# Altium schematic sheet matrix.SchDoc
size C; SheetNumber: 1; SheetTotal: 1
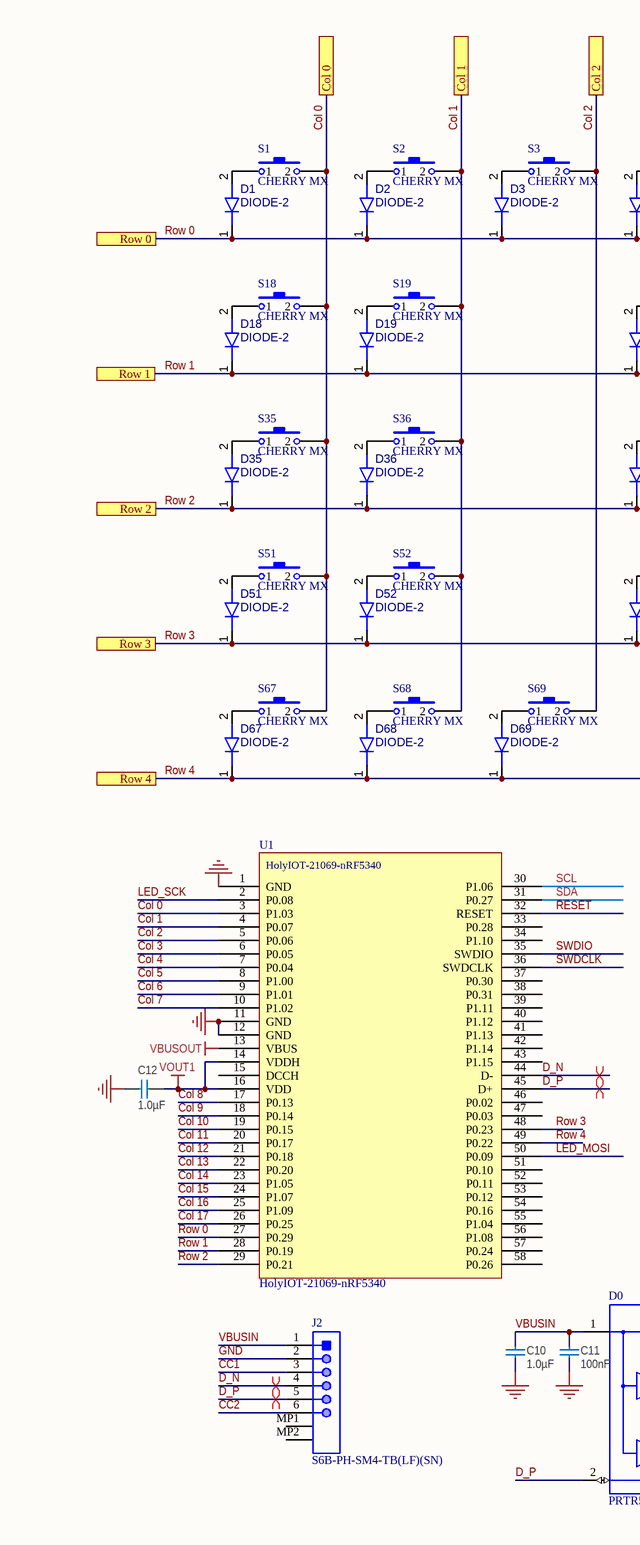
[diagram p0: matrix.SchDoc, left]
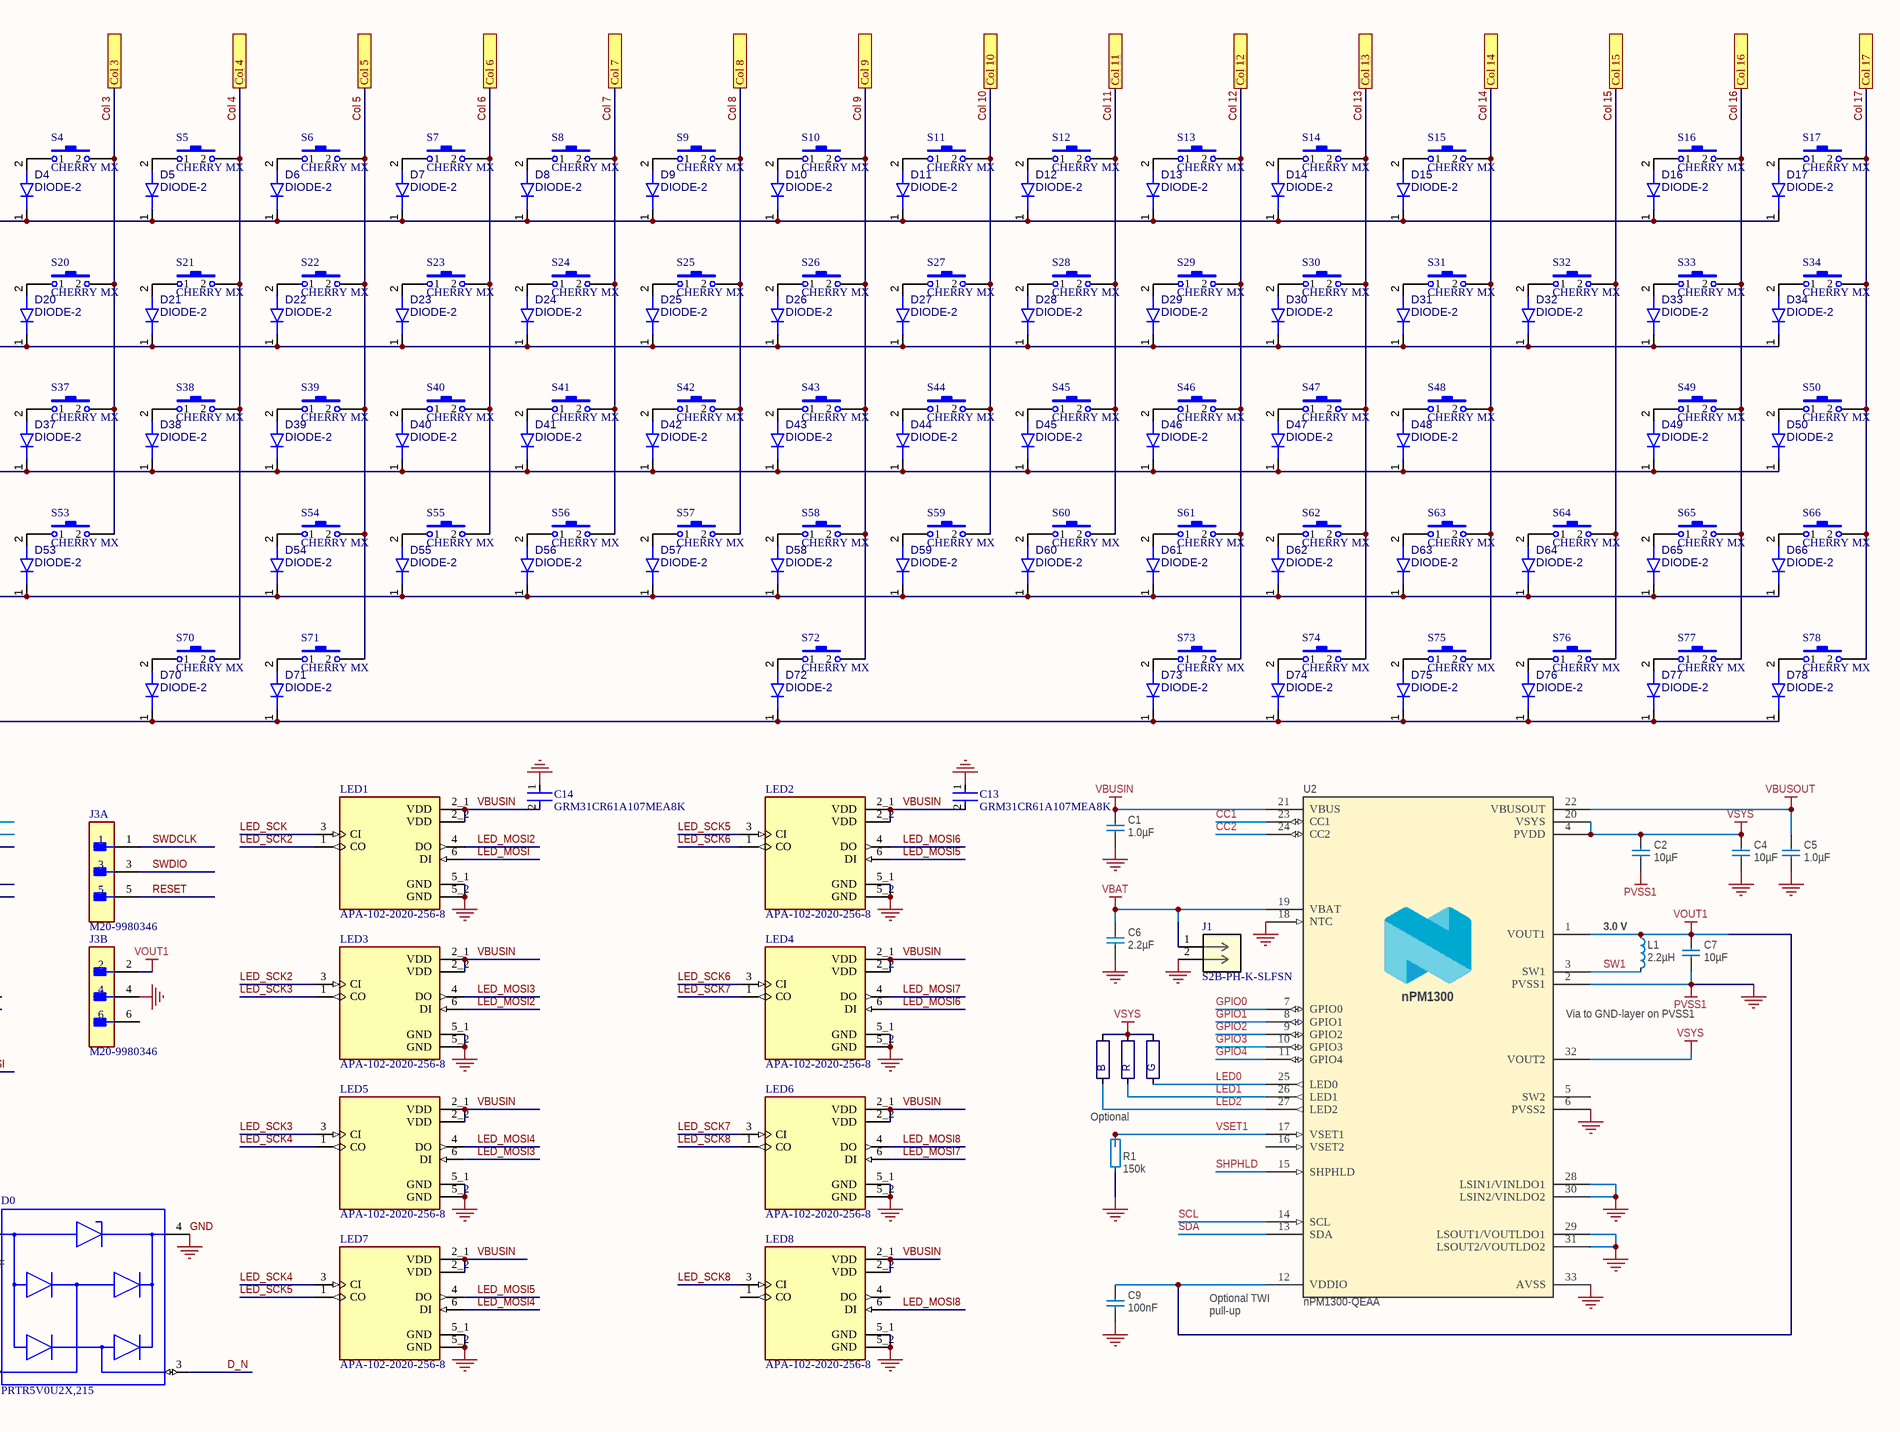
[diagram p1: matrix.SchDoc, right]

## Parts
B  0603  [CAPC1608X06L]  (value not drawn)
C1  1.0µF  [CAPC1608X06L]
C2  10µF  [CAPC1608X06L]
C4  10µF  [CAPC1608X06L]
C5  1.0µF  [CAPC1608X06L]
C6  2.2µF  [CAPC1608X06L]
C7  10µF  [CAPC1608X06L]
C9  100nF  [CAPC0603X03L_C]
C10  1.0µF  [CAPC1608X06L]
C11  100nF  [CAPC0603X03L_C]
C12  1.0µF  [CAPC1608X06L]
C13  GRM31CR61A107MEA8K  [FP-GRM31C-0_3-e0_3_0_8-MFG]
C14  GRM31CR61A107MEA8K  [FP-GRM31C-0_3-e0_3_0_8-MFG]
D0  PRTR5V0U2X,215  [FP-SOT143B-MFG]
D1  DIODE-2  [1N4148]
D2  DIODE-2  [1N4148]
D3  DIODE-2  [1N4148]
D4  DIODE-2  [1N4148]
D5  DIODE-2  [1N4148]
D6  DIODE-2  [1N4148]
D7  DIODE-2  [1N4148]
D8  DIODE-2  [1N4148]
D9  DIODE-2  [1N4148]
D10  DIODE-2  [1N4148]
D11  DIODE-2  [1N4148]
D12  DIODE-2  [1N4148]
D13  DIODE-2  [1N4148]
D14  DIODE-2  [1N4148]
D15  DIODE-2  [1N4148]
D16  DIODE-2  [1N4148]
D17  DIODE-2  [1N4148]
D18  DIODE-2  [1N4148]
D19  DIODE-2  [1N4148]
D20  DIODE-2  [1N4148]
D21  DIODE-2  [1N4148]
D22  DIODE-2  [1N4148]
D23  DIODE-2  [1N4148]
D24  DIODE-2  [1N4148]
D25  DIODE-2  [1N4148]
D26  DIODE-2  [1N4148]
D27  DIODE-2  [1N4148]
D28  DIODE-2  [1N4148]
D29  DIODE-2  [1N4148]
D30  DIODE-2  [1N4148]
D31  DIODE-2  [1N4148]
D32  DIODE-2  [1N4148]
D33  DIODE-2  [1N4148]
D34  DIODE-2  [1N4148]
D35  DIODE-2  [1N4148]
D36  DIODE-2  [1N4148]
D37  DIODE-2  [1N4148]
D38  DIODE-2  [1N4148]
D39  DIODE-2  [1N4148]
D40  DIODE-2  [1N4148]
D41  DIODE-2  [1N4148]
D42  DIODE-2  [1N4148]
D43  DIODE-2  [1N4148]
D44  DIODE-2  [1N4148]
D45  DIODE-2  [1N4148]
D46  DIODE-2  [1N4148]
D47  DIODE-2  [1N4148]
D48  DIODE-2  [1N4148]
D49  DIODE-2  [1N4148]
D50  DIODE-2  [1N4148]
D51  DIODE-2  [1N4148]
D52  DIODE-2  [1N4148]
D53  DIODE-2  [1N4148]
D54  DIODE-2  [1N4148]
D55  DIODE-2  [1N4148]
D56  DIODE-2  [1N4148]
D57  DIODE-2  [1N4148]
D58  DIODE-2  [1N4148]
D59  DIODE-2  [1N4148]
D60  DIODE-2  [1N4148]
D61  DIODE-2  [1N4148]
D62  DIODE-2  [1N4148]
D63  DIODE-2  [1N4148]
D64  DIODE-2  [1N4148]
D65  DIODE-2  [1N4148]
D66  DIODE-2  [1N4148]
D67  DIODE-2  [1N4148]
D68  DIODE-2  [1N4148]
D69  DIODE-2  [1N4148]
D70  DIODE-2  [1N4148]
D71  DIODE-2  [1N4148]
D72  DIODE-2  [1N4148]
D73  DIODE-2  [1N4148]
D74  DIODE-2  [1N4148]
D75  DIODE-2  [1N4148]
D76  DIODE-2  [1N4148]
D77  DIODE-2  [1N4148]
D78  DIODE-2  [1N4148]
G  0603  [CAPC1608X06L]  (value not drawn)
J1  S2B-PH-K-SLFSN  [CONN_S2B-PH-K-S_JST]
J2  S6B-PH-SM4-TB(LF)(SN)  [JST-S6B-PH-SM4-TB(LF)(SN)_V]
J3  M20-9980346  [FP-M20-9980346-MFG]  (parts A,B of 2)
L1  2.2µH  [INDC2016X10N]
LED1  APA-102-2020-256-8  [LED_APA-102-2020-256-8]
LED2  APA-102-2020-256-8  [LED_APA-102-2020-256-8]
LED3  APA-102-2020-256-8  [LED_APA-102-2020-256-8]
LED4  APA-102-2020-256-8  [LED_APA-102-2020-256-8]
LED5  APA-102-2020-256-8  [LED_APA-102-2020-256-8]
LED6  APA-102-2020-256-8  [LED_APA-102-2020-256-8]
LED7  APA-102-2020-256-8  [LED_APA-102-2020-256-8]
LED8  APA-102-2020-256-8  [LED_APA-102-2020-256-8]
R  0603  [CAPC1608X06L]  (value not drawn)
R1  150k  [RESC0603X03L_C]
S1  CHERRY MX  [1u-CHERRY-SMK-CUTOUT]
S2  CHERRY MX  [1u-CHERRY-SMK-CUTOUT]
S3  CHERRY MX  [1u-CHERRY-SMK-CUTOUT]
S4  CHERRY MX  [1u-CHERRY-SMK-CUTOUT]
S5  CHERRY MX  [1u-CHERRY-SMK-CUTOUT]
S6  CHERRY MX  [1u-CHERRY-SMK-CUTOUT]
S7  CHERRY MX  [1u-CHERRY-SMK-CUTOUT]
S8  CHERRY MX  [1u-CHERRY-SMK-CUTOUT]
S9  CHERRY MX  [1u-CHERRY-SMK-CUTOUT]
S10  CHERRY MX  [1u-CHERRY-SMK-CUTOUT]
S11  CHERRY MX  [1u-CHERRY-SMK-CUTOUT]
S12  CHERRY MX  [1u-CHERRY-SMK-CUTOUT]
S13  CHERRY MX  [1u-CHERRY-SMK-CUTOUT]
S14  CHERRY MX  [1u-CHERRY-SMK-CUTOUT]
S15  CHERRY MX  [1u-CHERRY-SMK-CUTOUT]
S16  CHERRY MX  [2u-STAB-CHERRY-SMK-CUTOUT]
S17  CHERRY MX  [1u-CHERRY-SMK-CUTOUT]
S18  CHERRY MX  [1u-CHERRY-SMK-CUTOUT]
S19  CHERRY MX  [1u-CHERRY-SMK-CUTOUT]
S20  CHERRY MX  [1.5u-CHERRY-SMK-CUTOUT]
S21  CHERRY MX  [1u-CHERRY-SMK-CUTOUT]
S22  CHERRY MX  [1u-CHERRY-SMK-CUTOUT]
S23  CHERRY MX  [1u-CHERRY-SMK-CUTOUT]
S24  CHERRY MX  [1u-CHERRY-SMK-CUTOUT]
S25  CHERRY MX  [1u-CHERRY-SMK-CUTOUT]
S26  CHERRY MX  [1u-CHERRY-SMK-CUTOUT]
S27  CHERRY MX  [1u-CHERRY-SMK-CUTOUT]
S28  CHERRY MX  [1u-CHERRY-SMK-CUTOUT]
S29  CHERRY MX  [1u-CHERRY-SMK-CUTOUT]
S30  CHERRY MX  [1u-CHERRY-SMK-CUTOUT]
S31  CHERRY MX  [1u-CHERRY-SMK-CUTOUT]
S32  CHERRY MX  [1u-CHERRY-SMK-CUTOUT]
S33  CHERRY MX  [1.5u-CHERRY-SMK-CUTOUT]
S34  CHERRY MX  [1u-CHERRY-SMK-CUTOUT]
S35  CHERRY MX  [1u-CHERRY-SMK-CUTOUT]
S36  CHERRY MX  [1u-CHERRY-SMK-CUTOUT]
S37  CHERRY MX  [1.75u-CHERRY-SMK-CUTOUT]
S38  CHERRY MX  [1u-CHERRY-SMK-CUTOUT]
S39  CHERRY MX  [1u-CHERRY-SMK-CUTOUT]
S40  CHERRY MX  [1u-CHERRY-SMK-CUTOUT]
S41  CHERRY MX  [1u-CHERRY-SMK-CUTOUT]
S42  CHERRY MX  [1u-CHERRY-SMK-CUTOUT]
S43  CHERRY MX  [1u-CHERRY-SMK-CUTOUT]
S44  CHERRY MX  [1u-CHERRY-SMK-CUTOUT]
S45  CHERRY MX  [1u-CHERRY-SMK-CUTOUT]
S46  CHERRY MX  [1u-CHERRY-SMK-CUTOUT]
S47  CHERRY MX  [1u-CHERRY-SMK-CUTOUT]
S48  CHERRY MX  [1u-CHERRY-SMK-CUTOUT]
S49  CHERRY MX  [2.25u-STAB-CHERRY-SMK-CUTOUT]
S50  CHERRY MX  [1u-CHERRY-SMK-CUTOUT]
S51  CHERRY MX  [1u-CHERRY-SMK-CUTOUT]
S52  CHERRY MX  [1u-CHERRY-SMK-CUTOUT]
S53  CHERRY MX  [2.25u-STAB-CHERRY-SMK-CUTOUT]
S54  CHERRY MX  [1u-CHERRY-SMK-CUTOUT]
S55  CHERRY MX  [1u-CHERRY-SMK-CUTOUT]
S56  CHERRY MX  [1u-CHERRY-SMK-CUTOUT]
S57  CHERRY MX  [1u-CHERRY-SMK-CUTOUT]
S58  CHERRY MX  [1u-CHERRY-SMK-CUTOUT]
S59  CHERRY MX  [1u-CHERRY-SMK-CUTOUT]
S60  CHERRY MX  [1u-CHERRY-SMK-CUTOUT]
S61  CHERRY MX  [1u-CHERRY-SMK-CUTOUT]
S62  CHERRY MX  [1u-CHERRY-SMK-CUTOUT]
S63  CHERRY MX  [1u-CHERRY-SMK-CUTOUT]
S64  CHERRY MX  [1.75u-CHERRY-SMK-CUTOUT]
S65  CHERRY MX  [1u-CHERRY-SMK-CUTOUT]
S66  CHERRY MX  [1u-CHERRY-SMK-CUTOUT]
S67  CHERRY MX  [1u-CHERRY-SMK-CUTOUT]
S68  CHERRY MX  [1u-CHERRY-SMK-CUTOUT]
S69  CHERRY MX  [1.25u-CHERRY-SMK-CUTOUT]
S70  CHERRY MX  [1.25u-CHERRY-SMK-CUTOUT]
S71  CHERRY MX  [1.25u-CHERRY-SMK-CUTOUT]
S72  CHERRY MX  [6.25u-STAB-CHERRY-SMK-CUTOUT]
S73  CHERRY MX  [1u-CHERRY-SMK-CUTOUT]
S74  CHERRY MX  [1u-CHERRY-SMK-CUTOUT]
S75  CHERRY MX  [1u-CHERRY-SMK-CUTOUT]
S76  CHERRY MX  [1u-CHERRY-SMK-CUTOUT]
S77  CHERRY MX  [1u-CHERRY-SMK-CUTOUT]
S78  CHERRY MX  [1u-CHERRY-SMK-CUTOUT]
U1  HolyIOT-21069-nRF5340  [HolyIOT-21069-nRF5340]
U2  nPM1300-QEAA  [Nordic_QFN50P500X500X90-33N]

## Ports
Col 0, Col 1, Col 2, Col 3, Col 4, Col 5, Col 6, Col 7, Col 8, Col 9, Col 10, Col 11, Col 12, Col 13, Col 14, Col 15, Col 16, Col 17, Row 0, Row 1, Row 2, Row 3, Row 4

## Nets
GND: C1.1 C2.1 C4.1 C5.1 C6.1 C7.1 C9.2 C10.1 C11.1 C12.1 C13.1 C14.1 D0.4(VCC) J1.2 J2.2 J3.4 LED1.5_1(GND) LED1.5_2(GND) LED2.5_1(GND) LED2.5_2(GND) LED3.5_1(GND) LED3.5_2(GND) LED4.5_1(GND) LED4.5_2(GND) LED5.5_1(GND) LED5.5_2(GND) LED6.5_1(GND) LED6.5_2(GND) LED7.5_1(GND) LED7.5_2(GND) LED8.5_1(GND) LED8.5_2(GND) R1.1 U1.1(GND) U1.11(GND) U1.12(GND) U2.2(PVSS1) U2.6(PVSS2) U2.18(NTC) U2.28(LSIN1/VINLDO1) U2.29(LSOUT1/VOUTLDO1) U2.30(LSIN2/VINLDO2) U2.31(LSOUT2/VOUTLDO2) U2.33(AVSS)  [also labelled PVSS1]
VBAT: C6.2 J1.1 U2.19(VBAT)
VBUSIN: C1.2 C10.2 C11.2 C13.2 C14.2 D0.1(GND) J2.1 LED1.2_1(VDD) LED1.2_2(VDD) LED2.2_1(VDD) LED2.2_2(VDD) LED3.2_1(VDD) LED3.2_2(VDD) LED4.2_1(VDD) LED4.2_2(VDD) LED5.2_1(VDD) LED5.2_2(VDD) LED6.2_1(VDD) LED6.2_2(VDD) LED7.2_1(VDD) LED7.2_2(VDD) LED8.2_1(VDD) LED8.2_2(VDD) U2.21(VBUS)
VBUSOUT: C5.2 U1.13(VBUS) U2.22(VBUSOUT)
VOUT1: C7.2 C9.1 C12.2 J3.2 L1.1 U1.14(VDDH) U1.16(VDD) U2.1(VOUT1) U2.12(VDDIO)
VSYS: B.1 C2.2 C4.2 G.1 R.1 U2.4(PVDD) U2.20(VSYS) U2.32(VOUT2)
CC1: J2.3 U2.23(CC1)
CC2: J2.6 U2.24(CC2)
Col 0: S1.2 S18.2 S35.2 S51.2 S67.2 U1.3(P1.03) ; port Col 0
Col 1: S2.2 S19.2 S36.2 S52.2 S68.2 U1.4(P0.07) ; port Col 1
Col 2: S3.2 S69.2 U1.5(P0.06) ; port Col 2
Col 3: S4.2 S20.2 S37.2 S53.2 U1.6(P0.05) ; port Col 3
Col 4: S5.2 S21.2 S38.2 S70.2 U1.7(P0.04) ; port Col 4
Col 5: S6.2 S22.2 S39.2 S54.2 S71.2 U1.8(P1.00) ; port Col 5
Col 6: S7.2 S23.2 S40.2 S55.2 U1.9(P1.01) ; port Col 6
Col 7: S8.2 S24.2 S41.2 S56.2 U1.10(P1.02) ; port Col 7
Col 8: S9.2 S25.2 S42.2 S57.2 U1.17(P0.13) ; port Col 8
Col 9: S10.2 S26.2 S43.2 S58.2 S72.2 U1.18(P0.14) ; port Col 9
Col 10: S11.2 S27.2 S44.2 S59.2 U1.19(P0.15) ; port Col 10
Col 11: S12.2 S28.2 S45.2 S60.2 U1.20(P0.17) ; port Col 11
Col 12: S13.2 S29.2 S46.2 S61.2 S73.2 U1.21(P0.18) ; port Col 12
Col 13: S14.2 S30.2 S47.2 S62.2 S74.2 U1.22(P0.20) ; port Col 13
Col 14: S15.2 S31.2 S48.2 S63.2 S75.2 U1.23(P1.05) ; port Col 14
Col 15: S32.2 S64.2 S76.2 U1.24(P1.07) ; port Col 15
Col 16: S16.2 S33.2 S49.2 S65.2 S77.2 U1.25(P1.09) ; port Col 16
Col 17: S17.2 S34.2 S50.2 S66.2 S78.2 U1.26(P0.25) ; port Col 17
D_N: D0.3(I/O_2) J2.4 U1.44(D-)
D_P: D0.2(I/O_1) J2.5 U1.45(D+)
GPIO0: U2.7(GPIO0)
GPIO1: U2.8(GPIO1)
GPIO2: U2.9(GPIO2)
GPIO3: U2.10(GPIO3)
GPIO4: U2.11(GPIO4)
LED0: G.2 U2.25(LED0)
LED1: R.2 U2.26(LED1)
LED2: B.2 U2.27(LED2)
LED_MOSI: LED1.6(DI) U1.50(P0.09)
LED_MOSI2: LED1.4(DO) LED3.6(DI)
LED_MOSI3: LED3.4(DO) LED5.6(DI)
LED_MOSI4: LED5.4(DO) LED7.6(DI)
LED_MOSI5: LED2.6(DI) LED7.4(DO)
LED_MOSI6: LED2.4(DO) LED4.6(DI)
LED_MOSI7: LED4.4(DO) LED6.6(DI)
LED_MOSI8: LED6.4(DO) LED8.6(DI)
LED_SCK: LED1.3(CI) U1.2(P0.08)
LED_SCK2: LED1.1(CO) LED3.3(CI)
LED_SCK3: LED3.1(CO) LED5.3(CI)
LED_SCK4: LED5.1(CO) LED7.3(CI)
LED_SCK5: LED2.3(CI) LED7.1(CO)
LED_SCK6: LED2.1(CO) LED4.3(CI)
LED_SCK7: LED4.1(CO) LED6.3(CI)
LED_SCK8: LED6.1(CO) LED8.3(CI)
RESET: J3.5 U1.32(RESET)
Row 0: D1.1(K) D2.1(K) D3.1(K) D4.1(K) D5.1(K) D6.1(K) D7.1(K) D8.1(K) D9.1(K) D10.1(K) D11.1(K) D12.1(K) D13.1(K) D14.1(K) D15.1(K) D16.1(K) D17.1(K) U1.27(P0.29) ; port Row 0
Row 1: D18.1(K) D19.1(K) D20.1(K) D21.1(K) D22.1(K) D23.1(K) D24.1(K) D25.1(K) D26.1(K) D27.1(K) D28.1(K) D29.1(K) D30.1(K) D31.1(K) D32.1(K) D33.1(K) D34.1(K) U1.28(P0.19) ; port Row 1
Row 2: D35.1(K) D36.1(K) D37.1(K) D38.1(K) D39.1(K) D40.1(K) D41.1(K) D42.1(K) D43.1(K) D44.1(K) D45.1(K) D46.1(K) D47.1(K) D48.1(K) D49.1(K) D50.1(K) U1.29(P0.21) ; port Row 2
Row 3: D51.1(K) D52.1(K) D53.1(K) D54.1(K) D55.1(K) D56.1(K) D57.1(K) D58.1(K) D59.1(K) D60.1(K) D61.1(K) D62.1(K) D63.1(K) D64.1(K) D65.1(K) D66.1(K) U1.48(P0.23) ; port Row 3
Row 4: D67.1(K) D68.1(K) D69.1(K) D70.1(K) D71.1(K) D72.1(K) D73.1(K) D74.1(K) D75.1(K) D76.1(K) D77.1(K) D78.1(K) U1.49(P0.22) ; port Row 4
SCL: U1.30(P1.06) U2.14(SCL)
SDA: U1.31(P0.27) U2.13(SDA)
SHPHLD: U2.15(SHPHLD)
SW1: L1.2 U2.3(SW1)
SWDCLK: J3.1 U1.36(SWDCLK)
SWDIO: J3.3 U1.35(SWDIO)
VSET1: R1.2 U2.17(VSET1)
NetD1_2: D1.2(A) S1.1
NetD2_2: D2.2(A) S2.1
NetD3_2: D3.2(A) S3.1
NetD4_2: D4.2(A) S4.1
NetD5_2: D5.2(A) S5.1
NetD6_2: D6.2(A) S6.1
NetD7_2: D7.2(A) S7.1
NetD8_2: D8.2(A) S8.1
NetD9_2: D9.2(A) S9.1
NetD10_2: D10.2(A) S10.1
NetD11_2: D11.2(A) S11.1
NetD12_2: D12.2(A) S12.1
NetD13_2: D13.2(A) S13.1
NetD14_2: D14.2(A) S14.1
NetD15_2: D15.2(A) S15.1
NetD16_2: D16.2(A) S16.1
NetD17_2: D17.2(A) S17.1
NetD18_2: D18.2(A) S18.1
NetD19_2: D19.2(A) S19.1
NetD20_2: D20.2(A) S20.1
NetD21_2: D21.2(A) S21.1
NetD22_2: D22.2(A) S22.1
NetD23_2: D23.2(A) S23.1
NetD24_2: D24.2(A) S24.1
NetD25_2: D25.2(A) S25.1
NetD26_2: D26.2(A) S26.1
NetD27_2: D27.2(A) S27.1
NetD28_2: D28.2(A) S28.1
NetD29_2: D29.2(A) S29.1
NetD30_2: D30.2(A) S30.1
NetD31_2: D31.2(A) S31.1
NetD32_2: D32.2(A) S32.1
NetD33_2: D33.2(A) S33.1
NetD34_2: D34.2(A) S34.1
NetD35_2: D35.2(A) S35.1
NetD36_2: D36.2(A) S36.1
NetD37_2: D37.2(A) S37.1
NetD38_2: D38.2(A) S38.1
NetD39_2: D39.2(A) S39.1
NetD40_2: D40.2(A) S40.1
NetD41_2: D41.2(A) S41.1
NetD42_2: D42.2(A) S42.1
NetD43_2: D43.2(A) S43.1
NetD44_2: D44.2(A) S44.1
NetD45_2: D45.2(A) S45.1
NetD46_2: D46.2(A) S46.1
NetD47_2: D47.2(A) S47.1
NetD48_2: D48.2(A) S48.1
NetD49_2: D49.2(A) S49.1
NetD50_2: D50.2(A) S50.1
NetD51_2: D51.2(A) S51.1
NetD52_2: D52.2(A) S52.1
NetD53_2: D53.2(A) S53.1
NetD54_2: D54.2(A) S54.1
NetD55_2: D55.2(A) S55.1
NetD56_2: D56.2(A) S56.1
NetD57_2: D57.2(A) S57.1
NetD58_2: D58.2(A) S58.1
NetD59_2: D59.2(A) S59.1
NetD60_2: D60.2(A) S60.1
NetD61_2: D61.2(A) S61.1
NetD62_2: D62.2(A) S62.1
NetD63_2: D63.2(A) S63.1
NetD64_2: D64.2(A) S64.1
NetD65_2: D65.2(A) S65.1
NetD66_2: D66.2(A) S66.1
NetD67_2: D67.2(A) S67.1
NetD68_2: D68.2(A) S68.1
NetD69_2: D69.2(A) S69.1
NetD70_2: D70.2(A) S70.1
NetD71_2: D71.2(A) S71.1
NetD72_2: D72.2(A) S72.1
NetD73_2: D73.2(A) S73.1
NetD74_2: D74.2(A) S74.1
NetD75_2: D75.2(A) S75.1
NetD76_2: D76.2(A) S76.1
NetD77_2: D77.2(A) S77.1
NetD78_2: D78.2(A) S78.1

Not connected (* = marked no-connect by the designer): J2 MP1 MP2; J3 6; LED8 1(CO) 4(DO); U1 15(DCCH) 33(P0.28) 34(P1.10) 37(P0.30) 38(P0.31) 39(P1.11) 40(P1.12) 41(P1.13) 42(P1.14) 43(P1.15) 46(P0.02) 47(P0.03) 51(P0.10) 52(P0.11) 53(P0.12) 54(P0.16) 55(P1.04) 56(P1.08) 57(P0.24) 58(P0.26); U2 5(SW2) 16(VSET2)

## Layout directives
differential pair: D_N, D_P

## Notes on the sheet
- (near L1) 3.0 V
- (near U2) Via to GND-layer on PVSS1
- (near R1) Optional LEDs
- (near U2) Optional TWI pull-up resistors
- (in symbol nPM1300-QEAA) nPM1300

## Library data of the parts
C1 C5 C10 C12 = C0603-1µ0-10V-X5R: Capacitor, Ceramic, 1.0µF 10V X5R 0603,±10%; Manufacturer: N.A.; Part number NEMS: 100200528; Pad Count: 2; Component Status: Active; Part Number: C0603-1µ0-10V-X5R; Manufacturer Part Number: N.A.; ComponentLink1URL: N.A.; ComponentLink1Description: Datasheet; ComponentLink2URL: N.A.; ComponentLink2Description: Supplier link; HelpURL: N.A.; Footprint Doc: 0603; LatestRevisionDate: 2022-10-06; Published: 2022-10-06; Value: 1.0µF; Note: 10V; Supplier 1: N.A.; Supplier Part Number 1: N.A.; Supplier 2: N.A.; Supplier Part Number 2: N.A.; Artikkelnr Noca: N.A.; Part number IPS: N.A.; Component Class: Capacitors; PartId: 100200528; Author: getr; Part number Norautron: N.A.
C2 C4 C7 = C0603-10µ: Capacitor, X5R, ±20%; Manufacturer: N.A.; Part number IPS: 00000007785; Part number NEMS: 100200275; Note: 6.3V; Artikkelnr Noca: 20039234; Pad Count: 2; Component Status: Active; Part Number: C0603-10µ; Manufacturer Part Number: N.A.; ComponentLink1URL: N.A.; ComponentLink1Description: Datasheet; ComponentLink2URL: N.A.; ComponentLink2Description: Supplier link; HelpURL: N.A.; Footprint Doc: 0603; LatestRevisionDate: 2011-01-17; Published: 2011-01-17; Value: 10µF; Supplier 1: N.A.; Supplier Part Number 1: N.A.; Supplier 2: N.A.; Supplier Part Number 2: N.A.; Component Class: Capacitors; PartId: 100200275; Author: rsk; Part number Norautron: N.A.
C6 = C0603-2.2µ-16V-X7R: Capacitor, Ceramic, X7R, ±10%, 16V; Manufacturer: Taiyo Yuden; Manufacturer Part Number: EMK107BB7225KA-T; Part number NEMS: 100200439; Component Status: Active; Pad Count: 2; Artikkelnr Noca: N.A.; Part Number: C0603-2.2µ-16V-X7R; PartId: 100200439; Component Class: Capacitors; Author: rsk; ComponentLink1URL: https://ds.yuden.co.jp/TYCOMPAS/ut/specSheet?pn=EMK107BB7225KA-T; ComponentLink1Description: Datasheet; ComponentLink2URL: https://ds.yuden.co.jp/TYCOMPAS/ut/detail?pn=EMK107BB7225KA-T&u=M; ComponentLink2Description: Supplier link; HelpURL: https://www.digikey.no/product-detail/en/taiyo-yuden/EMK107BB7225KA-T/587-5835-2-ND/4970646; LatestRevisionDate: 2020-10-13; Published: 2020-02-03; Footprint Doc: 0603; Value: 2.2µF; Note: 16V; Supplier 1: Digi-Key; Supplier Part Number 1: 587-5835-2-ND; Supplier 2: N.A.; Supplier Part Number 2: N.A.; Part number IPS: N.A.; Part number Norautron: N.A.
C9 C11 = C0201-100n: Capacitor, X5R, ±10%; Manufacturer: N.A.; Part number IPS: 00000001248, 00000002505; Part number Norautron: 262071862; Part number NEMS: 100200078; Pad Count: 2; Note: 16V; Component Status: Active; Part Number: C0201-100n; PartId: 100200078; Component Class: Capacitors; Author: rsk; Manufacturer Part Number: N.A.; ComponentLink1URL: N.A.; ComponentLink1Description: Datasheet; ComponentLink2URL: N.A.; ComponentLink2Description: Supplier link; HelpURL: N.A.; Footprint Doc: 0201; LatestRevisionDate: 2017-11-09; Published: 2014-11-13; Value: 100nF; Supplier 1: N.A.; Supplier Part Number 1: N.A.; Supplier 2: N.A.; Supplier Part Number 2: N.A.; Artikkelnr Noca: N.A.
C13 C14 = CMP-06035-028924-1: Chip Multilayer Ceramic Capacitors for General Purpose, 1206, 100uF, X5R, 15%, 20%, 10V
D0 = CMP-00030-00001-1: Trans Voltage Suppressor Diode, 5.5V V(RWM), Unidirectional, 1 Element, Silicon; Case Connection: ANODE; Package Body Material: Plastic; Time @ Peak Reflow Temperature-Max (s): 30s; Max Breakdown Voltage: 9V; Number of Elements: 1; Min Breakdown Voltage: 6V; JESD-609 Code: e3; Polarity: Unidirectional; Terminal Form: Gull Wing; Peak Reflow Temperature (Cel): 260°C; Surface Mount: Yes; Reach SVHC Compliant: Yes; Package Style: SMALL OUTLINEMeter; RoHS Compliant: Yes; JESD-30 Code: R-PDSO-G4; Moisture Sensitivity Level: 1; Technology: AVALANCHE; Package Shape: Rectangular; Pins: 4; Terminal Position: DUAL; Diode Type: TRANS VOLTAGE SUPPRESSOR; Terminal Finish: Tin; Diode Element Material: SILICON; Rep Pk Reverse Voltage-Max: 5.5V
D1-D78 = 1N4148: Diode
J1 = S2B-PH-K-SLFSN: No Description Available; Mfr_Name: JST; RefDes: RefDes; Type: Type
J2 = S6B-PH-SM4-TB: Male Header, Pitch 2 mm, 1 x 6 Position, Height 5.5 mm, -25 to 85 degC; Manufacturer: JST; Pitch: 2mm; Style/Orientation: RightAngleHeader/Plug; No of Positions: 6; Package Reference: S6B-PH-SM4-TB(LF)(SN); Type: ShroudedHeader; Package Description: Male Header, Pitch 2 mm, 1 x 6 Position, Height 5.5 mm; Mounting Technology: SurfaceMount; Datasheet Version: 11/2008; Termination: Solder; Datasheet URL: https://datasheet.ciiva.com/11747/0900766b80df0d9d-11747278.pdf; Manufacturer URL: http://www.jst.com/home2.html
J3 = CMP-2000-06636-2: CONN HEADER VERT 6POS 2.54MM; Manufacturer: Harwin; Current Rating: 3A; Number Of Contacts: 6; Conn Gender: Male; Conn Orientation: Vertical; Device Class L1: Connectors; ComponentLink2Description: Datasheet; Height: 8.99mm; Temperature Range High: +105°C; Contact Material: Tin,Nickel; RoHS: TRUE; Temperature Range Low: -40°C; ComponentLink2URL: https://cdn.harwin.com/pdfs/M20-998.pdf; Digikey Description: CONN HEADER VERT 6POS 2.54MM; Pitch: 2.54mm; Package: M20-9980346; Device Class L2: Headers and Wire Housings; Manufacturer Part Number: M20-9980346; Number Of Rows: 2; Category: Conn; Lead Free: Yes; Mouser Description: 2.54mm (0.1") Pitch DIL Vertical PC Tail Pin Header, 6.1mm mating pin height, tin, 3+3 contacts; Temperature: -40°C to +105°C; Device Class L3: unset; Octopart: https://octopart.com/m20-9980346-harwin-5436545; Automotive: No
L1 = L0806-2µ2-2500mA-73mOhm-CIGT201610EH2R2MNE: Inductor, Irms=2.5A, Isat=2.9A, ±20%, DCR=73mΩ; Manufacturer: Samsung Electro-Mechanics; Part number Norautron: 26521789; Part number NEMS: 100300400; Pad Count: 2; Note: Unshielded Thin Film Inductor; Artikkelnr Noca: N.A.; Component Status: Active; Part Number: L0806-2µ2-2500mA-73mOhm-CIGT201610EH2R2MNE; PartId: 100300400; Component Class: Inductors; Author: rsk; Manufacturer Part Number: CIGT201610EH2R2MNE; ComponentLink1URL: https://media.digikey.com/pdf/Data%20Sheets/Samsung%20PDFs/CIGT201610EH2R2MNE_Spec.pdf; ComponentLink1Description: Datasheet; ComponentLink2URL: https://www.digikey.com/en/products/detail/samsung-electro-mechanics/CIGT201610EH2R2MNE/7041223?s=N4IgTCBcDaIMIEkDiAVMAGAjANk%2BgogBJgBKYAsgHL4gC6AvkA; ComponentLink2Description: Supplier link; HelpURL: http://product.samsungsem.com/pi/CIGT201610EH2R2MN.do; Footprint Doc: 0806; LatestRevisionDate: 2022-09-07; Published: 2021-02-03; Value: 2.2µH; Supplier 1: Digi-Key; Supplier Part Number 1: 1276-6901-1-ND; Supplier 2: Mouser; Supplier Part Number 2: 187-CIGT201610EH2R2M; Part number IPS: N.A.
LED1-LED8 = APA-102-2020-256-8: 8-pin type LED three-color RGB Dimming control; MF: iPixel LED Light Co.; Package: SMD-8 iPixel LED Light Co.; Price: None; Value: *; SnapEDA_Link: https://www.snapeda.com/parts/APA-102-2020-256-8/iPixel+LED+Light+Co./view-part/?ref=snap; MP: APA-102-2020-256-8; Availability: Not in stock; Check_prices: https://www.snapeda.com/parts/APA-102-2020-256-8/iPixel+LED+Light+Co./view-part/?ref=eda
R1 = R0201-150k: Resistor, ±1%, 0.05W; Manufacturer: N.A.; Part number IPS: 00000001422; Part number NEMS: 100100082; Component Status: Active; Pad Count: 2; Note: Chip Res 1%; Part Number: R0201-150k; PartId: 100100082; Component Class: Resistors; Author: rsk; Manufacturer Part Number: N.A.; ComponentLink1URL: N.A.; ComponentLink1Description: Datasheet; ComponentLink2URL: N.A.; ComponentLink2Description: Supplier link; HelpURL: N.A.; LatestRevisionDate: 2014-11-13; Published: 2014-11-13; Footprint Doc: 0201; Value: 150k; Supplier 1: N.A.; Supplier Part Number 1: N.A.; Supplier 2: N.A.; Supplier Part Number 2: N.A.; Artikkelnr Noca: N.A.; Part number Norautron: N.A.
S1-S78 = CHERRY MX: Switch; Published: 24-Mar-1999; LatestRevisionDate: 17-Jul-2002; LatestRevisionNote: Re-released for DXP Platform.; PackageReference: SPST-2; Publisher: Altium Limited; PackageDescription: Switch; 2 Leads
U2 = nPM1300-QEAA: Li-Ion/Li-Polymer USB-C battery charger with high efficiency buck regulators, LDOs or load switches, LED drivers, TWI and VBUSOUT; Manufacturer: Nordic Semiconductor; Part number NEMS: 102000252; Component Status: Active; Pad Count: 33; Note: N.A.; Part Number: nPM1300-QEAA; PartId: 102000252; Component Class: nRF_Devices; Author: eisk; Manufacturer Part Number: nPM1300-QEAA; ComponentLink1URL: N.A.; ComponentLink1Description: Datasheet; ComponentLink2URL: N.A.; ComponentLink2Description: Supplier link; HelpURL: N.A.; LatestRevisionDate: 2022-11-14; Published: 2022-02-17; Footprint Doc: QFN-32; Value: nPM1300-QEAA; Supplier 1: Nordic Semiconductor; Supplier Part Number 1: nPM1300-QEAA; Supplier 2: N.A.; Supplier Part Number 2: N.A.; Artikkelnr Noca: N.A.; Part number IPS: N.A.; Part number Norautron: N.A.